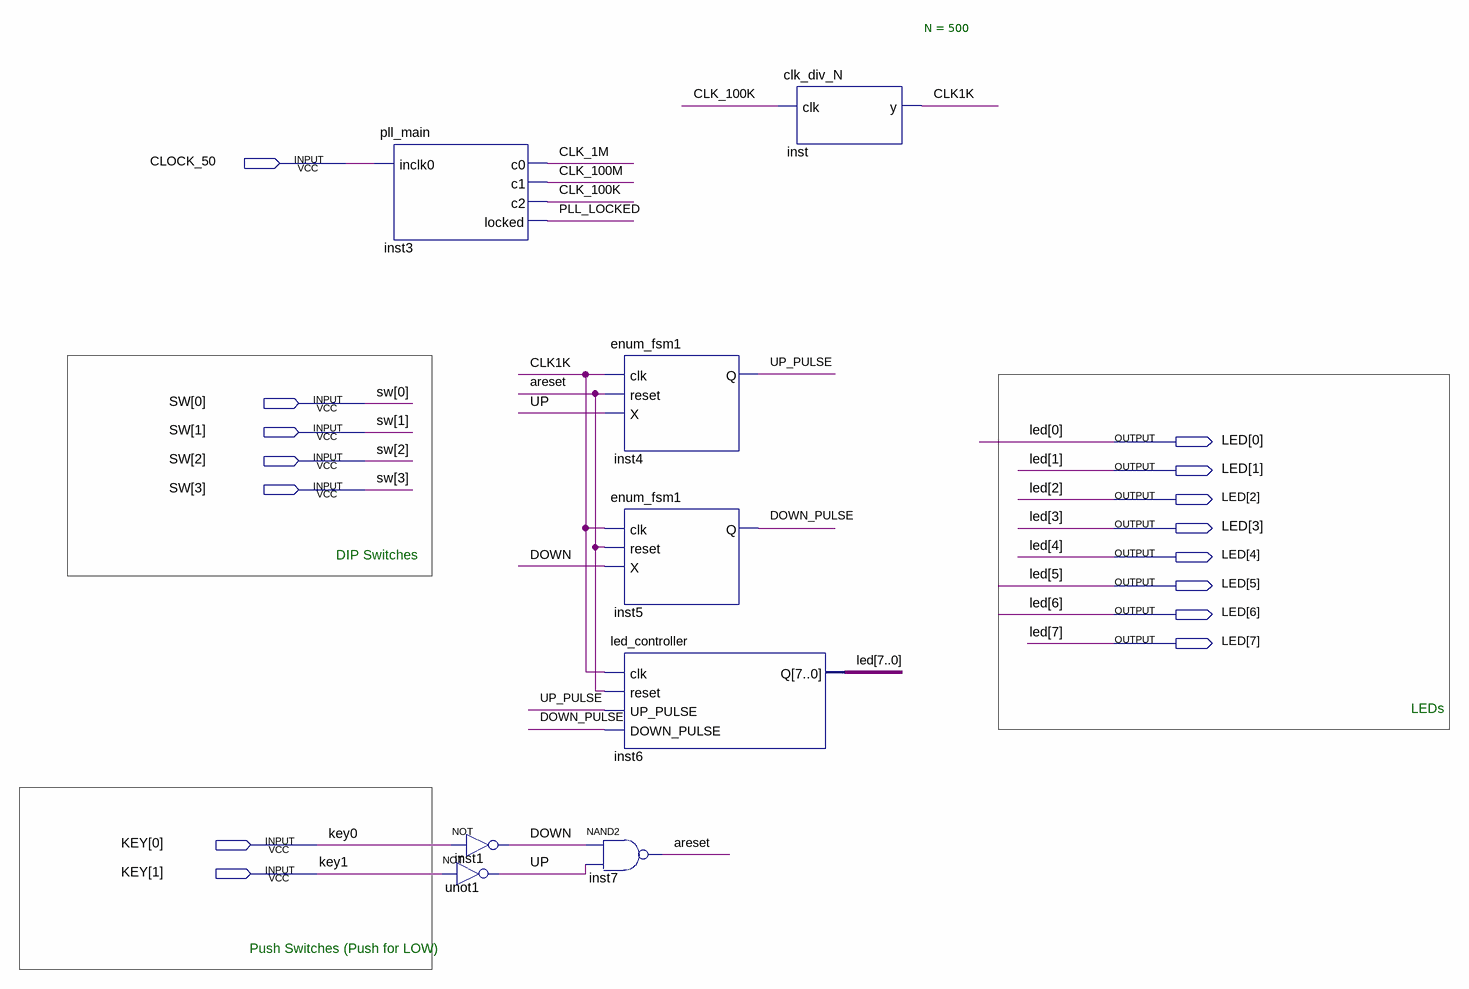
[diagram p0: schematic sheet]
// Quartus schematic TopLevelSchematic.bdf as structural Verilog: 8 symbols, 15 pins
module TopLevelSchematic (
  input  CLOCK_50,
  input  [3:0] SW,
  input  [1:0] KEY,
  output [7:0] LED
);

  wire areset, CLK1K, CLK_1M, CLK_100K, CLK_100M, DOWN, DOWN_PULSE, PLL_LOCKED, UP, UP_PULSE;

  pll_main inst3 (.inclk0(CLOCK_50), .c0(CLK_1M), .c1(CLK_100M), .c2(CLK_100K), .locked(PLL_LOCKED));
  not inst1 (DOWN, KEY[0]);
  not unot1 (UP, KEY[1]);
  nand inst7 (areset, DOWN, UP);
  enum_fsm1 inst4 (.clk(CLK1K), .reset(areset), .X(UP), .Q(UP_PULSE));
  enum_fsm1 inst5 (.clk(CLK1K), .reset(areset), .X(DOWN), .Q(DOWN_PULSE));
  led_controller inst6 (.clk(CLK1K), .reset(areset), .UP_PULSE(UP_PULSE), .DOWN_PULSE(DOWN_PULSE), .Q(LED));
  clk_div_N #(.N(500)) inst (.clk(CLK_100K), .y(CLK1K));

  // Notes on the sheet:
  //   DIP Switches
  //   LEDs
  //   Push Switches (Push for LOW)
endmodule
